# Altium schematic sheet MT-MacthCard V2.1.0.SchDoc
size D; SheetNumber: 0; SheetTotal: 0
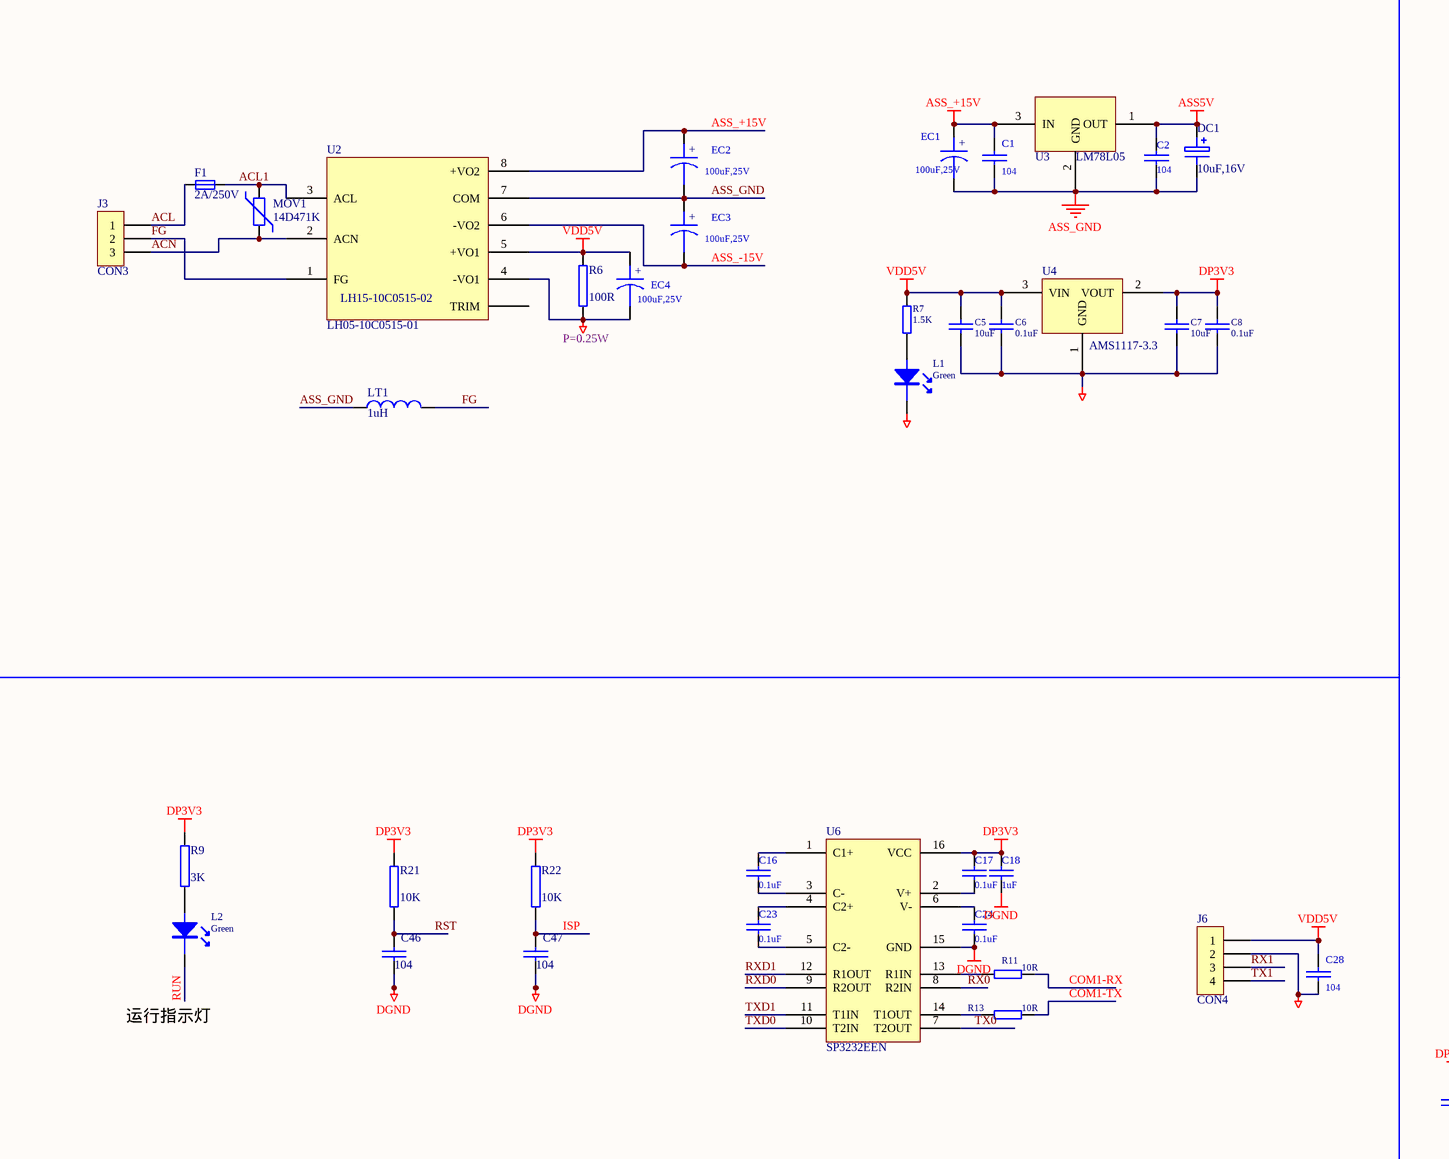
[diagram p0: MT-MacthCard V2.1.0.SchDoc, top left]
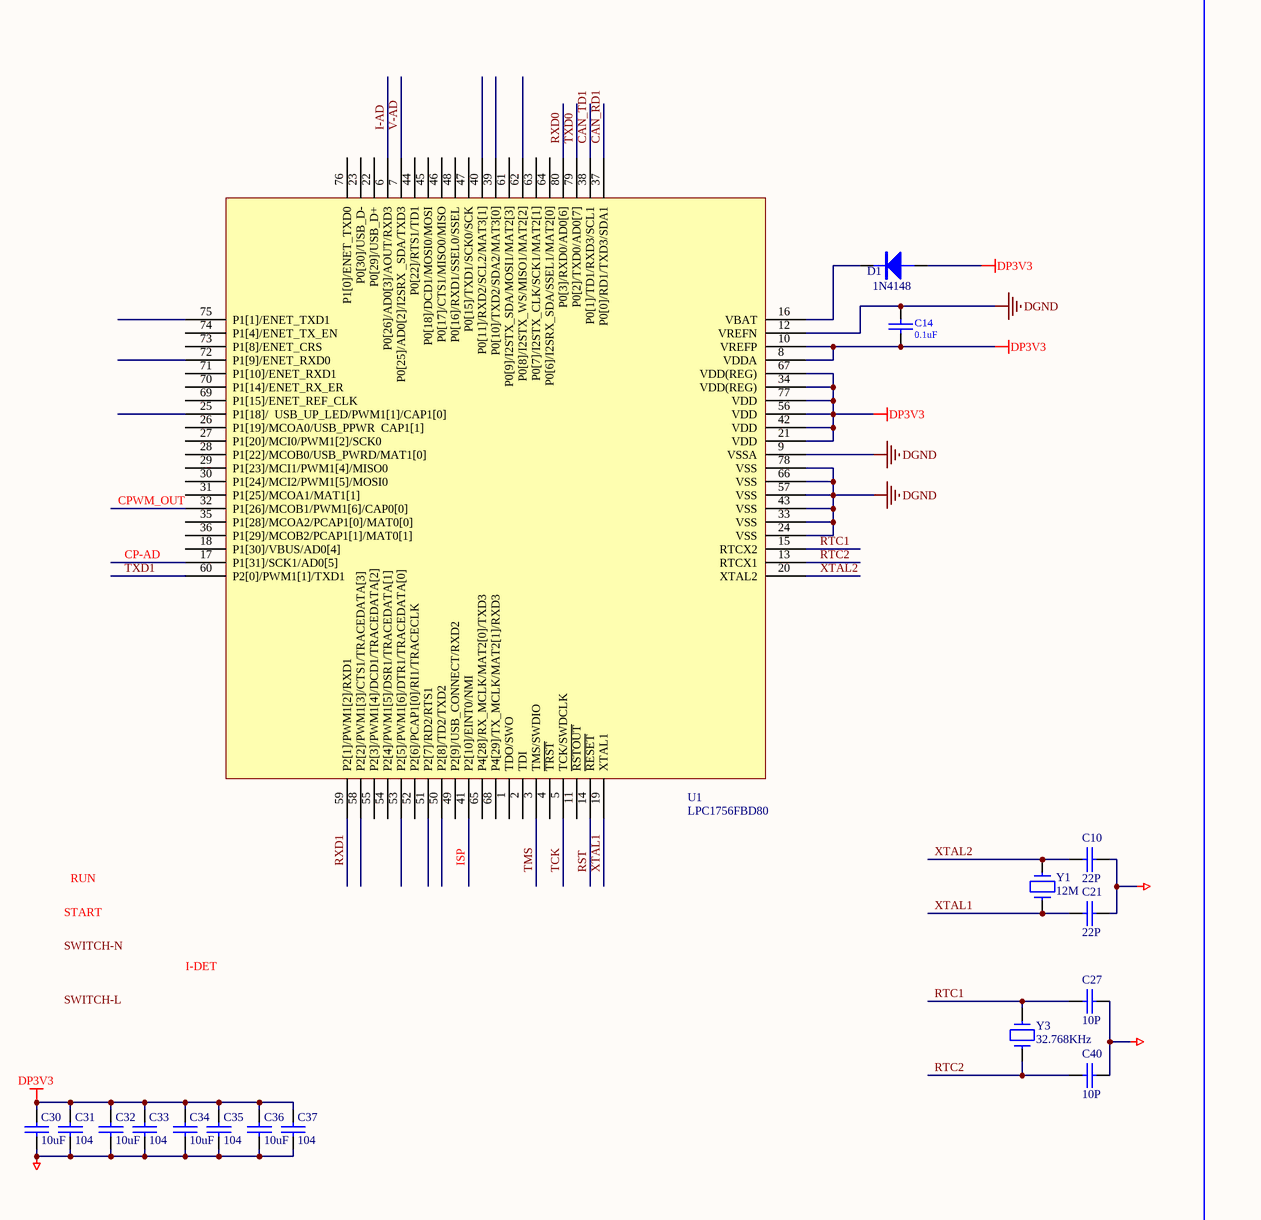
[diagram p1: MT-MacthCard V2.1.0.SchDoc, top middle]
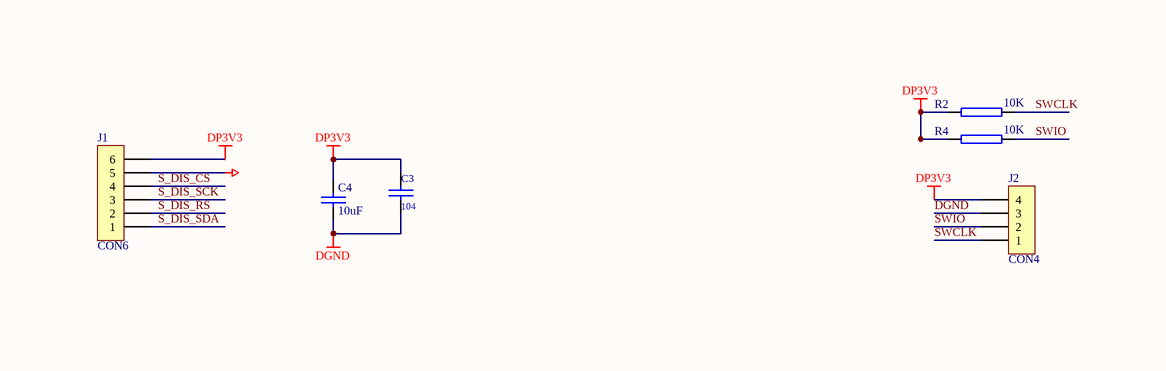
[diagram p2: MT-MacthCard V2.1.0.SchDoc, top right]
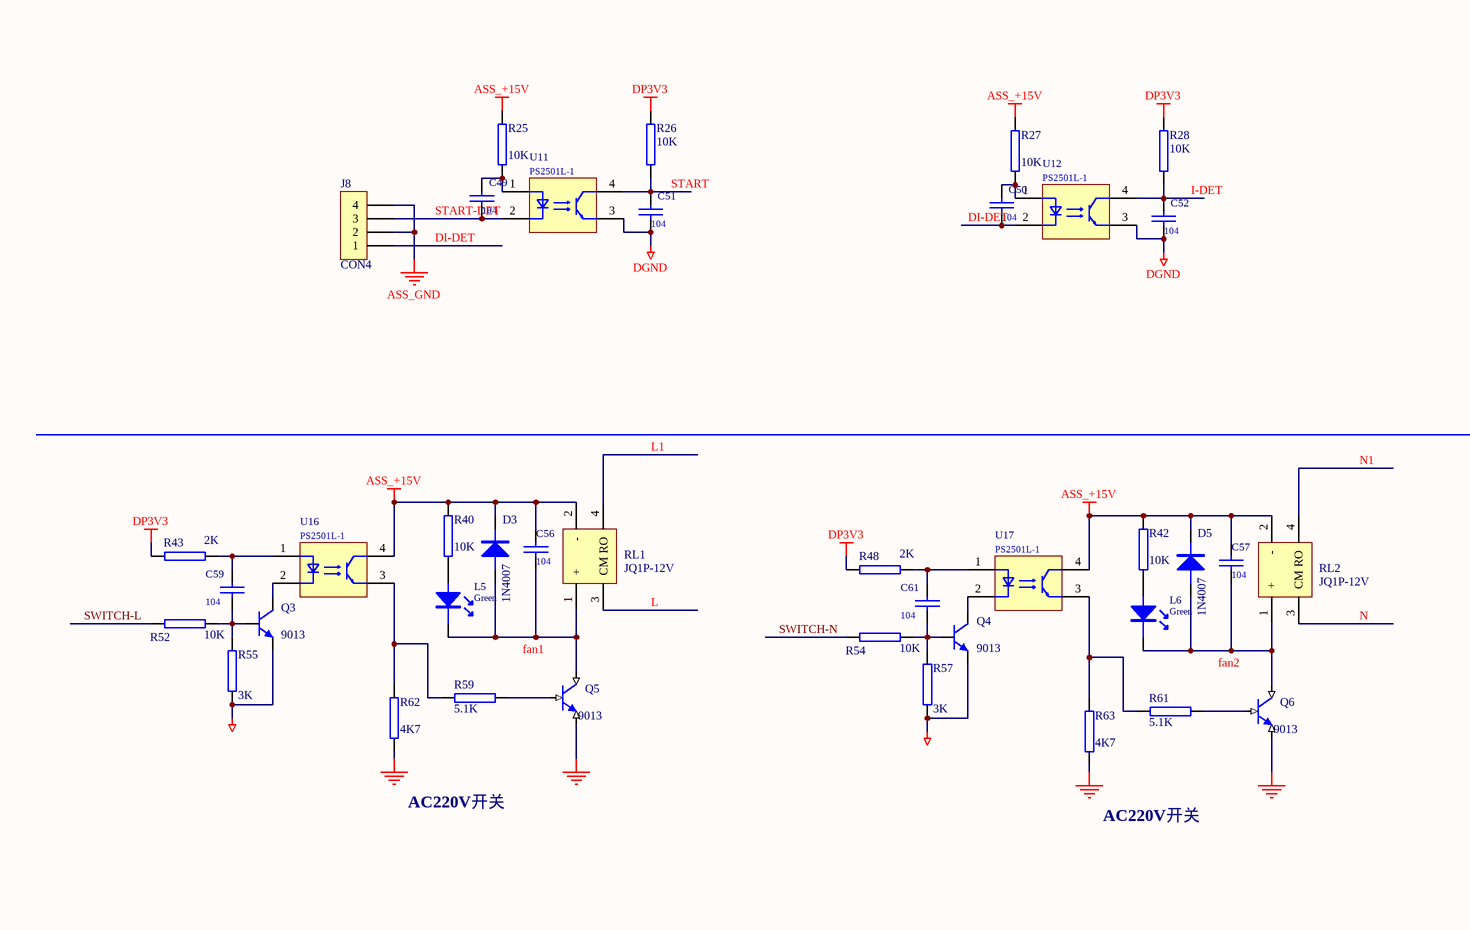
[diagram p3: MT-MacthCard V2.1.0.SchDoc, bottom left]
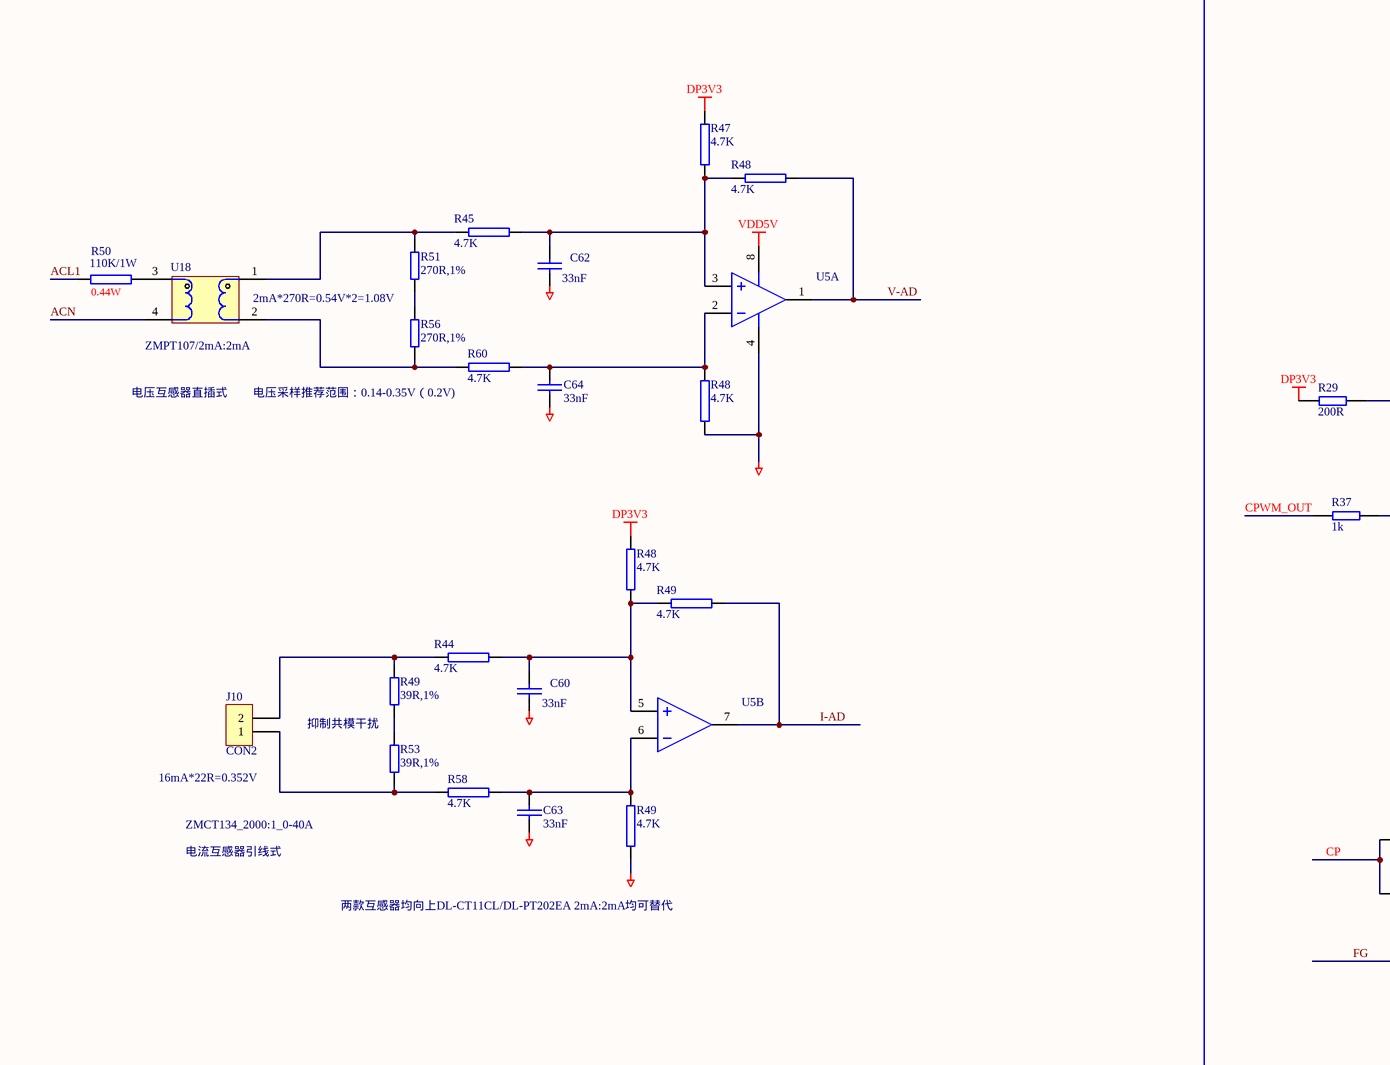
[diagram p4: MT-MacthCard V2.1.0.SchDoc, bottom middle]
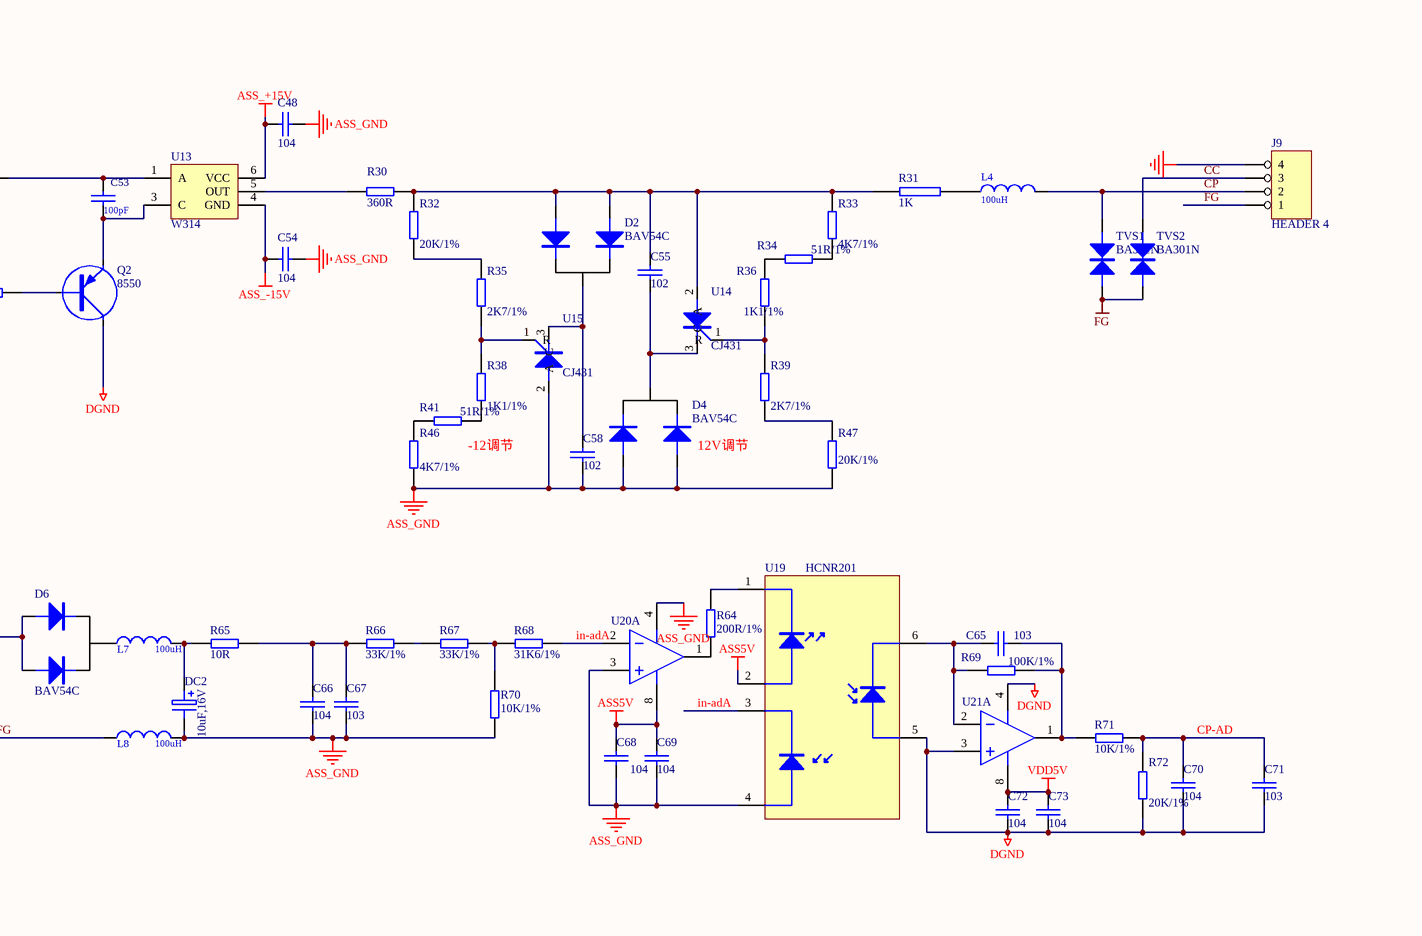
[diagram p5: MT-MacthCard V2.1.0.SchDoc, bottom right]

## Parts
(Parts that share a designator on the sheet are numbered #1, #2 ... from top to bottom, then left to right.)
C1  104  [0603C]
C2  104  [0603C]
C3  104  [0603C]
C4  10uF  [0805C]
C5  10uF  [0805C]
C6  0.1uF  [0603C]
C7  10uF  [0805C]
C8  0.1uF  [0603C]
C10  22P  [0603C]
C14  0.1uF  [0603C]
C16  0.1uF  [0603C]
C17  0.1uF  [0603C]
C18  1uF  [0603C]
C21  22P  [0603C]
C23  0.1uF  [0603C]
C24  0.1uF  [0603C]
C27  10P  [0603C]
C28  104  [0603C]
C30  10uF  [0805C]
C31  104  [0603C]
C32  10uF  [0805C]
C33  104  [0603C]
C34  10uF  [0805C]
C35  104  [0603C]
C36  10uF  [0805C]
C37  104  [0603C]
C40  10P  [0603C]
C46  104  [0603C]
C47  104  [0603C]
C48  104  [0603C]
C49  104  [0603C]
C50  104  [0603C]
C51  104  [0603C]
C52  104  [0603C]
C53  100pF  [0603C]
C54  104  [0603C]
C55  102  [0603C]
C56  104  [0805C]
C57  104  [0805C]
C58  102  [0603C]
C59  104  [0603C]
C60  33nF  [0603C]
C61  104  [0603C]
C62  33nF  [0603C]
C63  33nF  [0603C]
C64  33nF  [0603C]
C65  103  [0603C]
C66  104  [0603C]
C67  103  [0603C]
C68  104  [0603C]
C69  104  [0603C]
C70  104  [0603C]
C71  103  [0603C]
C72  104  [0603C]
C73  104  [0603C]
D1  1N4148  [1206D]
D2  BAV54C  [SOT23]
D3  1N4007  [DO-214AC]
D4  BAV54C  [SOT23]
D5  1N4007  [DO-214AC]
D6  BAV54C  [SOT23]
DC1  10uF,16V  [CA1206]
DC2  10uF,16V  [CA1206]
EC1  100uF,25V  [C100UF16VEJ]
EC2  100uF,25V  [C100UF16VEJ]
EC3  100uF,25V  [C100UF16VEJ]
EC4  100uF,25V  [C100UF16VEJ]
F1  2A/250V  [方形保险丝]
J1  CON6  [CON06_2.54]
J2  CON4  [CON04_2.54]
J3  CON3  [CON-5.08MM-4P]
J6  CON4  [KF2EDG-4P-3.81mm]
J8  CON4  [KF2EDG-4P-3.81MM]
J9  HEADER 4  [KF2EDG-4P-3.81mm]
J10  CON2  [CON2P]
L1  Green  [D0805]
L2  Green  [D0805]
L4  100uH  [1206L]
L5  Green  [D0805]
L6  Green  [D0805]
L7  100uH  [1206L]
L8  100uH  [1206L]
LT1  1uH  [1206L]
MOV1  14D471K  [10D471K]
Q2  8550  [SOT23]
Q3  9013  [SOT23]
Q4  9013  [SOT23]
Q5  9013  [SOT23]
Q6  9013  [SOT23]
R2  10K  [0603R]
R4  10K  [0603R]
R6  100R  [R1-1]
R7  1.5K  [0603R]
R9  3K  [0603R]
R11  10R  [0603R]
R13  10R  [0603R]
R21  10K  [0603R]
R22  10K  [0603R]
R25  10K  [0603R]
R26  10K  [0603R]
R27  10K  [0603R]
R28  10K  [0603R]
R29  200R  [0603R]
R30  360R  [1206R]
R31  1K  [1206R]
R32  20K/1%  [0603R]
R33  4K7/1%  [0603R]
R34  51R/1%  [0603R]
R35  2K7/1%  [0603R]
R36  1K1/1%  [0603R]
R37  1k  [0603R]
R38  1K1/1%  [0603R]
R39  2K7/1%  [0603R]
R40  10K  [0603R]
R41  51R/1%  [0603R]
R42  10K  [0603R]
R43  2K  [0603R]
R44  4.7K  [0603R]
R45  4.7K  [0603R]
R46  4K7/1%  [0603R]
R47#1  4.7K  [0603R]
R47#2  20K/1%  [0603R]
R48#1  4.7K  [0603R]
R48#2  4.7K  [0603R]
R48#3  4.7K  [0603R]
R48#4  2K  [0603R]
R49#1  4.7K  [0603R]
R49#2  39R,1%  [0603R]
R49#3  4.7K  [0603R]
R50  110K/1W  [R1-2]
R51  270R,1%  [0603R]
R52  10K  [0603R]
R53  39R,1%  [0603R]
R54  10K  [0603R]
R55  3K  [0603R]
R56  270R,1%  [0603R]
R57  3K  [0603R]
R58  4.7K  [0603R]
R59  5.1K  [0603R]
R60  4.7K  [0603R]
R61  5.1K  [0603R]
R62  4K7  [0603R]
R63  4K7  [0603R]
R64  200R/1%  [0603R]
R65  10R  [0603R]
R66  33K/1%  [0603R]
R67  33K/1%  [0603R]
R68  31K6/1%  [0603R]
R69  100K/1%  [0603R]
R70  10K/1%  [0603R]
R71  10K/1%  [0603R]
R72  20K/1%  [0603R]
RL1  JQ1P-12V  [HF32F-12V]
RL2  JQ1P-12V  [HF32F-12V]
TVS1  BA301N  [3528TVS]
TVS2  BA301N  [3528TVS]
U1  LPC1756FBD80  [LQFP-80]
U2  LH05-10C0515-01  [LH05-10C0515-01]
U3  LM78L05  [SOT-89]
U4  AMS1117-3.3  [SOT223]
U5  LM258  [SOP8]  (value not drawn)  (parts A,B of 2)
U6  SP3232EEN  [SO-16]
U11  PS2501L-1  [DIP-4]
U12  PS2501L-1  [DIP-4]
U13  W314  [w314 - duplicate]
U14  CJ431  [SOT23]
U15  CJ431  [SOT23]
U16  PS2501L-1  [DIP-4]
U17  PS2501L-1  [DIP-4]
U18  ZMPT107/2mA:2mA  [ZMPT107]
U19  HCNR201  [HCNR201 - S]
U20  LM258  [SOP8]  (value not drawn)  (part A of 2)
U21  LM258  [SOP8]  (value not drawn)  (part A of 2)
Y1  12M  [ZS_SMD]
Y3  32.768KHz  [ZS-32.768]

## Nets
ASS5V: C2.2 C68.2 C69.1 DC1.1 U3.1(OUT) U19.2 U20.8(VCC)
ASS_+15V: C1.2 C48.1 C56.1 C57.1 D3.2(K) D5.2(K) EC1.1 EC2.1 R25.2 R27.2 R40.2 R42.2 RL1.2(-) RL2.2(-) U2.8(+VO2) U3.3(IN) U13.6(VCC) U16.4 U17.4
ASS_-15V: C54.1 EC3.2 U2.6(-VO2) U13.4(GND)
ASS_GND: C1.1 C2.1 C48.2 C54.2 C58.2 C66.2 C67.2 C68.1 C69.2 D4.1(A) D4.3(A) DC1.2 DC2.2 EC1.2 EC2.2 EC3.1 J8.2 J8.4 J9.4 L8.2 LT1.1 Q5.3(E) Q6.3(E) R46.1 R47#2.1 R62.2 R63.2 R70.1 U2.7(COM) U3.2(GND) U15.2(A) U19.4 U20.3(IN+) U20.4(GND)
DGND: C3.1 C4.2 C5.2 C6.2 C7.2 C8.2 C10.2 C14.1 C18.1 C21.2 C24.1 C27.2 C28.1 C30.2 C31.2 C32.2 C33.2 C34.2 C35.2 C36.2 C37.2 C40.2 C46.1 C47.1 C51.2 C52.2 C60.2 C62.2 C63.2 C64.2 C70.1 C71.1 C72.1 C73.1 EC4.2 J1.5 J2.3 J6.2 L1.2 Q2.2(C) Q3.3(E) Q4.3(E) R6.1 R48#2.1 R49#3.1 R55.2 R57.2 R72.2 U1.9(VSSA) U1.12(VREFN) U1.24(VSS) U1.33(VSS) U1.43(VSS) U1.57(VSS) U1.66(VSS) U1.78(VSS) U2.4(-VO1) U4.1(GND) U5.4(GND) U6.15(GND) U11.3 U12.3 U19.5 U21.3(IN+) U21.4(GND)
DP3V3: C3.2 C4.1 C7.1 C8.1 C14.2 C17.2 C18.2 C30.1 C31.1 C32.1 C33.1 C34.1 C35.1 C36.1 C37.1 D1.1(A) J1.6 J2.4 R2.2 R4.2 R9.2 R21.1 R22.1 R26.2 R28.2 R29.1 R43.2 R47#1.2 R48#3.2 R48#4.2 U1.8(VDDA) U1.10(VREFP) U1.21(VDD) U1.34(VDD(REG)) U1.42(VDD) U1.56(VDD) U1.67(VDD(REG)) U1.77(VDD) U4.2(VOUT) U6.16(VCC)
FG: J3.2 J9.1 L8.1 LT1.2 TVS1.1 TVS2.1 U2.1(FG)
VDD5V: C5.1 C6.1 C28.2 C72.2 C73.2 EC4.1 J6.1 R6.2 R7.1 U2.5(+VO1) U4.3(VIN) U5.8(VCC) U21.8(VCC)
ACL: F1.2 J3.1
ACL1: F1.1 MOV1.2 R50.1 U2.3(ACL)
ACN: J3.3 MOV1.1 U2.2(ACN) U18.4
CAN_RD1: U1.37(P0[0]/RD1/TXD3/SDA1)
CAN_TD1: U1.38(P0[1]/TD1/RXD3/SCL1)
CC: J9.3 TVS2.2
COM1-RX: R11.2
COM1-TX: R13.2
CP: D6.1(A) D6.3(A) J9.2 L4.1 TVS1.2
CP-AD: C70.2 C71.2 R71.2 R72.1 U1.17(P1[31]/SCK1/AD0[5])
CPWM_OUT: R37.1 U1.32(P1[26]/MCOB1/PWM1[6]/CAP0[0])
DI-DET: C50.2 J8.1 U12.2
I-AD: R49#1.2 U1.6(P0[26]/AD0[3]/AOUT/RXD3) U5.7(OUT)
I-DET: C52.1 R28.1 U12.4
in-adA: R68.2 U19.3 U20.2(IN-)
ISP: C47.2 R22.2 U1.41(P2[10]/EINT0/NMI)
L: RL1.3(CM)
L1: RL1.4(RO)
N: RL2.3(CM)
N1: RL2.4(RO)
RST: C46.2 R21.2 U1.14(~{RESET})
RTC1: C27.1 U1.15(RTCX2) Y3.1
RTC2: C40.1 U1.13(RTCX1) Y3.2
RUN: L2.2
RX0: U6.8(R2IN)
RX1: J6.3
RXD0: U1.80(P0[3]/RXD0/AD0[6]) U6.9(R2OUT)
RXD1: U1.59(P2[1]/PWM1[2]/RXD1) U6.12(R1OUT)
S_DIS_CS: J1.4
S_DIS_RS: J1.2
S_DIS_SCK: J1.3
S_DIS_SDA: J1.1
START: C51.1 R26.1 U11.4
START-DET: C49.2 J8.3 U11.2
SWCLK: J2.1 R2.1
SWIO: J2.2 R4.1
SWITCH-L: R52.2
SWITCH-N: R54.2
TCK: U1.5(TCK/SWDCLK)
TMS: U1.3(TMS/SWDIO)
TX0: U6.7(T2OUT)
TX1: J6.4
TXD0: U1.79(P0[2]/TXD0/AD0[7]) U6.10(T2IN)
TXD1: U1.60(P2[0]/PWM1[1]/TXD1) U6.11(T1IN)
V-AD: R48#1.2 U1.7(P0[25]/AD0[2]/I2SRX__SDA/TXD3) U5.1(OUT)
XTAL1: C21.1 U1.19(XTAL1) Y1.2
XTAL2: C10.1 U1.20(XTAL2) Y1.1
NetC16_1: C16.1 U6.3(C-)
NetC16_2: C16.2 U6.1(C1+)
NetC17_1: C17.1 U6.2(V+)
NetC23_1: C23.1 U6.5(C2-)
NetC23_2: C23.2 U6.4(C2+)
NetC24_2: C24.2 U6.6(V-)
NetC49_1: C49.1 R25.1 U11.1
NetC50_1: C50.1 R27.1 U12.1
NetC53_1: C53.1 R29.2 U13.1(A)
NetC53_2: C53.2 Q2.3(E) U13.3(C)
NetC55_1: C55.1 D4.2(K) U14.3(C)
NetC55_2: C55.2 D2.1(A) D2.3(A) R30.1 R31.1 R32.2 R33.2 U14.2(A)
NetC56_2: C56.2 D3.1(A) L5.2 Q5.2(C) RL1.1(+)
NetC57_2: C57.2 D5.1(A) L6.2 Q6.2(C) RL2.1(+)
NetC58_1: C58.1 D2.2(K) U15.3(C)
NetC59_1: C59.1 R43.1 U16.1
NetC59_2: C59.2 Q3.1(B) R52.1 R55.1
NetC60_1: C60.1 R44.2 R48#3.1 R49#1.1 U5.5(IN+)
NetC61_1: C61.1 R48#4.1 U17.1
NetC61_2: C61.2 Q4.1(B) R54.1 R57.1
NetC62_1: C62.1 R45.2 R47#1.1 R48#1.1 U5.3(IN+)
NetC63_1: C63.1 R49#3.2 R58.2 U5.6(IN-)
NetC64_1: C64.1 R48#2.2 R60.2 U5.2(IN-)
NetC65_1: C65.1 R69.1 R71.1 U21.1(OUT)
NetC65_2: C65.2 R69.2 U19.6 U21.2(IN-)
NetC66_1: C66.1 C67.1 R65.2 R66.1
NetD1_2: D1.2(K) U1.16(VBAT)
NetD6_2: D6.2(K) L7.1
NetDC2_1: DC2.1 L7.2 R65.1
NetJ10_1: J10.1 R53.1 R58.1
NetJ10_2: J10.2 R44.1 R49#2.2
NetL1_1: L1.1 R7.2
NetL2_1: L2.1 R9.1
NetL4_2: L4.2 R31.2
NetL5_1: L5.1 R40.1
NetL6_1: L6.1 R42.1
NetQ2_1: Q2.1(B) R37.2
NetQ3_2: Q3.2(C) U16.2
NetQ4_2: Q4.2(C) U17.2
NetQ5_1: Q5.1(B) R59.2
NetQ6_1: Q6.1(B) R61.2
NetR11_1: R11.1 U6.13(R1IN)
NetR13_1: R13.1 U6.14(T1OUT)
NetR30_2: R30.2 U13.5(OUT)
NetR32_1: R32.1 R35.2
NetR33_1: R33.1 R34.2
NetR34_1: R34.1 R36.2
NetR35_1: R35.1 R38.2 U15.1(R)
NetR36_1: R36.1 R39.2 U14.1(R)
NetR38_1: R38.1 R41.2
NetR39_1: R39.1 R47#2.2
NetR41_1: R41.1 R46.2
NetR45_1: R45.1 R51.2 U18.1
NetR49#2_1: R49#2.1 R53.2
NetR50_2: R50.2 U18.3
NetR51_1: R51.1 R56.2
NetR56_1: R56.1 R60.1 U18.2
NetR59_1: R59.1 R62.1 U16.3
NetR61_1: R61.1 R63.1 U17.3
NetR64_1: R64.1 U20.1(OUT)
NetR64_2: R64.2 U19.1
NetR66_2: R66.2 R67.1
NetR67_2: R67.2 R68.1 R70.2

Not connected (* = marked no-connect by the designer): U1 1(TDO/SWO) 2(TDI) 4(~{TRST}) 11(~{RSTOUT}) 18(P1[30]/VBUS/AD0[4]) 22(P0[29]/USB_D+) 23(P0[30]/USB_D-) 25(P1[18]/__USB_UP_LED/PWM1[1]/CAP1[0]) 26(P1[19]/MCOA0/USB_PPWR__CAP1[1]) 27(P1[20]/MCI0/PWM1[2]/SCK0) 28(P1[22]/MCOB0/USB_PWRD/MAT1[0]) 29(P1[23]/MCI1/PWM1[4]/MISO0) 30(P1[24]/MCI2/PWM1[5]/MOSI0) 31(P1[25]/MCOA1/MAT1[1]) 35(P1[28]/MCOA2/PCAP1[0]/MAT0[0]) 36(P1[29]/MCOB2/PCAP1[1]/MAT0[1]) 39(P0[10]/TXD2/SDA2/MAT3[0]) 40(P0[11]/RXD2/SCL2/MAT3[1]) 44(P0[22]/RTS1/TD1) 45(P0[18]/DCD1/MOSI0/MOSI) 46(P0[17]/CTS1/MISO0/MISO) 47(P0[15]/TXD1/SCK0/SCK) 48(P0[16]/RXD1/SSEL0/SSEL) 49(P2[9]/USB_CONNECT/RXD2) 50(P2[8]/TD2/TXD2) 51(P2[7]/RD2/RTS1) 52(P2[6]/PCAP1[0]/RI1/TRACECLK) 53(P2[5]/PWM1[6]/DTR1/TRACEDATA[0]) 54(P2[4]/PWM1[5]/DSR1/TRACEDATA[1]) 55(P2[3]/PWM1[4]/DCD1/TRACEDATA[2]) 58(P2[2]/PWM1[3]/CTS1/TRACEDATA[3]) 61(P0[9]/I2STX_SDA/MOSI1/MAT2[3]) 62(P0[8]/I2STX_WS/MISO1/MAT2[2]) 63(P0[7]/I2STX_CLK/SCK1/MAT2[1]) 64(P0[6]/I2SRX_SDA/SSEL1/MAT2[0]) 65(P4[28]/RX_MCLK/MAT2[0]/TXD3) 68(P4[29]/TX_MCLK/MAT2[1]/RXD3) 69(P1[15]/ENET_REF_CLK) 70(P1[14]/ENET_RX_ER) 71(P1[10]/ENET_RXD1) 72(P1[9]/ENET_RXD0) 73(P1[8]/ENET_CRS) 74(P1[4]/ENET_TX_EN) 75(P1[1]/ENET_TXD1) 76(P1[0]/ENET_TXD0); U2 ?1(TRIM)

## Notes on the sheet
- P=0.25W
- 运行指示灯
- (near R50) 0.44W
- (near U18) 2mA*270R=0.54V*2=1.08V
- 电压互感器直插式
- (near R56) 电压采样推荐范围：0.14-0.35V（0.2V)
- (near R41) -12调节
- (near D4) 12V调节
- 抑制共模干扰
- (near J10) 16mA*22R=0.352V
- 电流互感器引线式
- ZMCT134_2000:1_0-40A
- AC220V开关
- 两款互感器均向上DL-CT11CL/DL-PT202EA 2mA:2mA均可替代
- Labels drawn without touching a wire or pin: fan1, fan2, I-DET, RUN, START, SWITCH-L, SWITCH-N
- (in symbol CAPACITOR POL) +
- (in symbol LH05-10C0515-01) LH15-10C0515-02

## Library data of the parts
C1 C2 C28 = CAP: 0805贴片电容/50V/0.1uF/±10%/X7R
C3 C5-C8 C16-C18 C23 C24 C56 C57 C59 C61 = CAP: Capacitor
C4 C10 C21 C27 C30-C37 C40 = CAP1
C14 = CAP_3: Capacitor
C46-C48 C54 C55 C58 C66 C68-C70 C72 C73 = CAP1: 0603贴片电容/50V/0.1uF/±10%/X7R
C49-C53 = CAP: 0603贴片电容/50V/0.1uF/±10%/X7R
C60 C62-C64 = CAP1: 0603贴片电容/50V/33nF/±10%/X7R
C65 C67 C71 = CAP1: 0603贴片电容/50V/10nF/±10%/X7R
D1 D3 D5 = DIODE
DC1 DC2 = CAP2: 贴片钽电容/16V/10uF/A型3216/AVX
EC1-EC4 = CAPACITOR POL: 贴片铝电解电容/16V/100uF/6.3*5.4
F1 = FUSE
J1 = CON6: Connector
J2 J6 J8 = CON4: Connector
J3 = CON3: Connector
J9 = 4 HEADER: 4 Pin Header
J10 = CON2: Connector
L1 L2 L5 L6 = LED: 17-21/GHC-XS1T2M/3T,绿色LED/0805/亿光
L4 LT1 = INDUCTOR
L7 L8 = INDUCTOR: 贴片功率电感/100uH/LC7*7*3
MOV1 = NTC
Q2 = PNP: PNP Transistor
Q3-Q6 = NPN
R2 R4 R40 R42 R43 R48#4 R50 R52 R54 R55 R57 R59 R61-R63 = RES1
R6 = RES1: 0603贴片电阻/2K/0.1W/±1%
R7 R11 R13 = RES-1: RES
R9 R29 R37 = RES1: 0603贴片电阻/200R/0.1W/±5%
R21 R22 R26 R28 = RES1: 0603贴片电阻/10K/0.1W/±5%
R25 R27 = RES1: 0603贴片电阻/2K/0.1W/±5%
R30 = RES1: 0603贴片电阻/10R/0.1W/±5%
R31 = RES2: 五色环/轴状/金属膜电阻/1K/1W/±1%
R32 R47#2 = RES1: 0603贴片电阻/20K/0.1W/±1%
R33 R46 = RES1: 0603贴片电阻/4.7K/0.1W/±1%
R34 R41 = RES1: 0603贴片电阻/51R/0.1W/±1%
R35 R39 = RES1: 0603贴片电阻/2.7K/0.1W/±1%
R36 R38 = RES1: 0603贴片电阻/1.1K/0.1W/±1%
R44 R45 R47#1 R48#1-R48#3 R49#1 R49#3 R58 R60 = RES1: 0603贴片电阻/1.2K/0.1W/±5%
R49#2 R51 R53 R56 = RES-1: 0603贴片电阻/2R/0.1W/±5%
R64 = RES1: 0603贴片电阻/200R/0.1W/±1%
R65-R67 R70 = RES1: 0603贴片电阻/33K/0.1W/±1%
R68 R69 = RES1: 0603贴片电阻/31.6K/0.1W/±1%
R71 R72 = RES1: 0603贴片电阻/10K/0.1W/±1%
TVS1 TVS2 = TVS
U1 = LPC1756FBD80: LPC1756FBD80,LQFP-80_12x12x05P,NXP
U2 = LH05-10C0515-01: LH05-10C0515-01,金升阳,48.5*36*20.5
U3 = LM7805: LM78L05,SOT-89
U4 = AMS1117
U5 U20 U21 = AS358P-E1: LM258,SOIC8,TI
U6 = MAX232ESE: NSOIC
U11 U12 = PS2501-1: PS2501L-1,SOP4,CEL
U13 = TLP113: TLP114A,5_PIN,TOSHIBA
U14 U15 = TL431: TL431,SOT23/ST/ON
U16 U17 = PS2501-1
U18 = ZMPT107
U19 = HCNR200: HCNR201,DIP8,HP
Y1 = CRYSTAL: 32.768KHz晶振/圆柱形/2*6mm
Y3 = CRYSTAL